# EAGLE design marquee-neopixel (EAGLE 8.6.1)
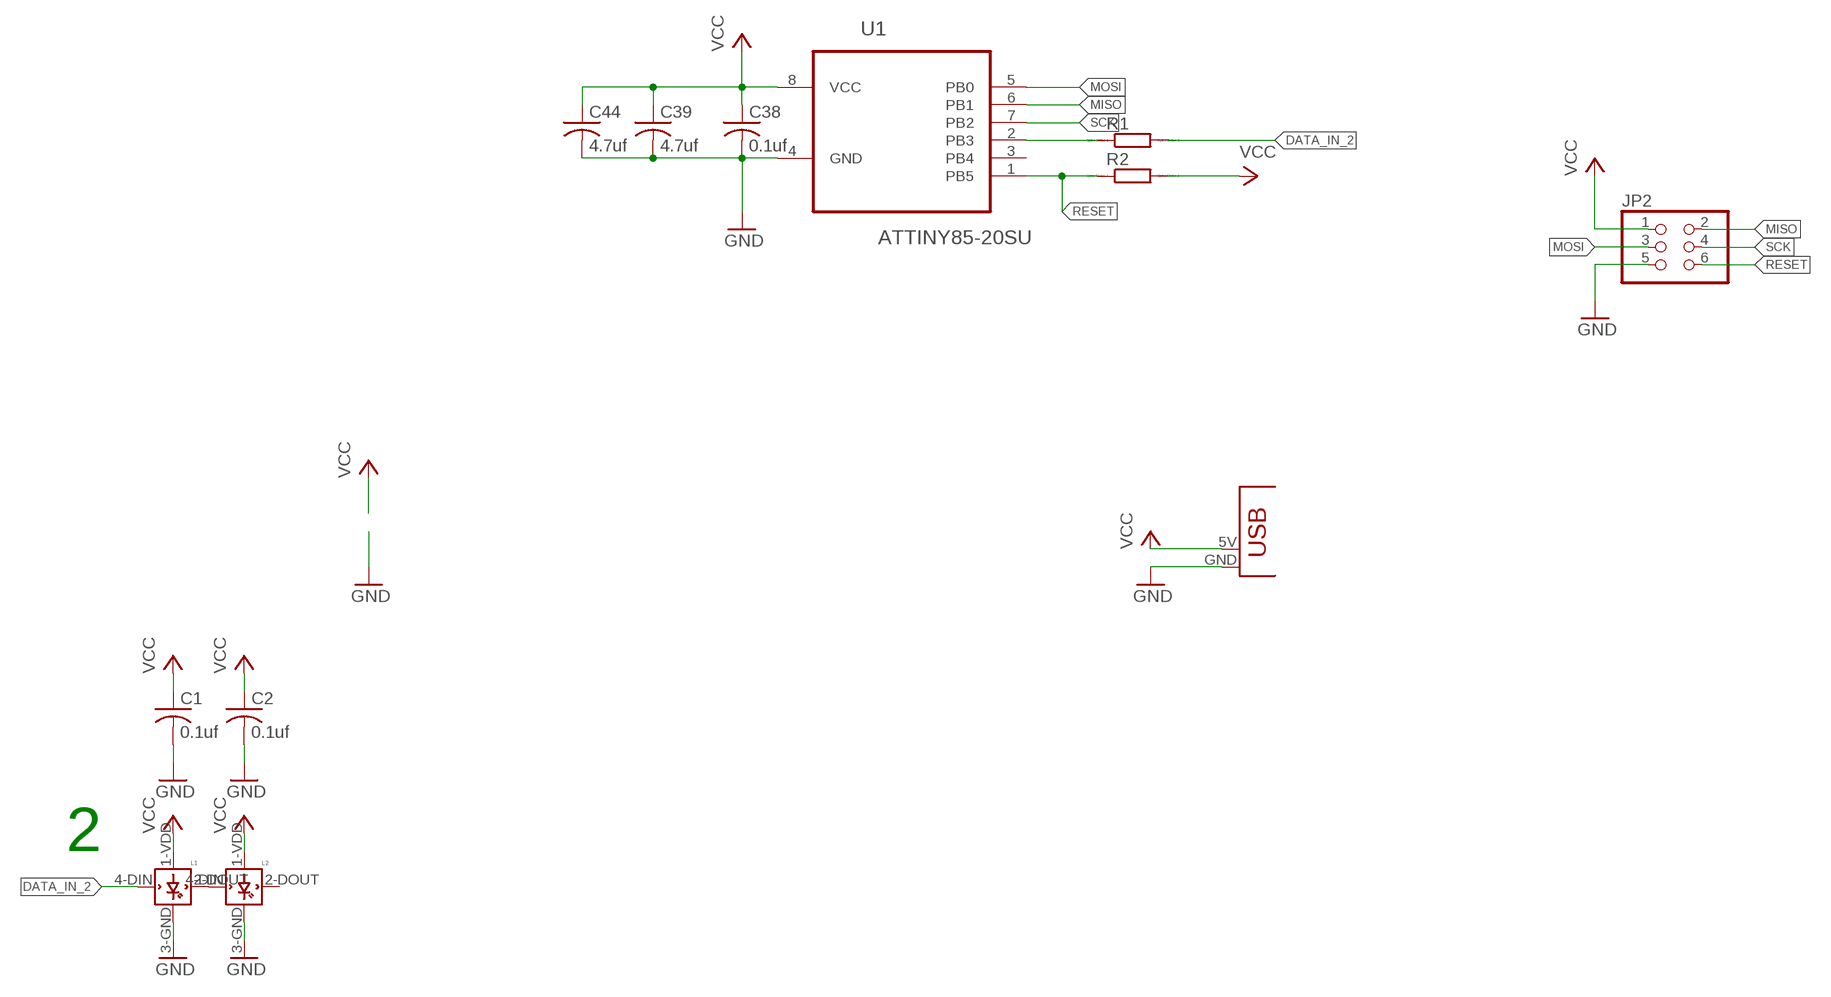
[diagram p0: schematic, sheet 1]

## Parts
C1  0.1uf  C-USC0603  [C0603]
C2  0.1uf  C-USC0603  [C0603]
C38  0.1uf  C-USC0603  [C0603]
C39  4.7uf  C-USC0603  [C0603]
C44  4.7uf  C-USC0603  [C0603]
JP2  PINHD-2X3  [2X03]
L1  WS2812B  [WS2812B]
L2  WS2812B  [WS2812B]
R1  RR0603  [R0603]
R2  RR0603  [R0603]
U1  ATTINY85-20SU  [SOIC127P798X216-8N]
U$1  USB-POWER-ONLY  [USB-A-PCB-POWER-ONLY]

## Nets
DATA_IN_2: L1.4-DIN(DIN) R1.2
GND: C1.2 C2.2 C38.2 C39.2 C44.2 JP2.5 L1.3-GND(GND) L2.3-GND(GND) U1.4(GND) U$1.GND
MISO: JP2.2 U1.6(PB1)
MOSI: JP2.3 U1.5(PB0)
N$1: L1.2-DOUT(DOUT) L2.4-DIN(DIN)
N$25: R1.1 U1.2(PB3)
RESET: JP2.6 R2.1 U1.1(PB5)
SCK: JP2.4 U1.7(PB2)
VCC: C1.1 C2.1 C38.1 C39.1 C44.1 JP2.1 L1.1-VDD(VDD) L2.1-VDD(VDD) R2.2 U1.8(VCC) U$1.5V(VBUS)
Unconnected: L2.2-DOUT(DOUT) U1.3(PB4)

## Notes on the sheet
- 2

## Library data of the parts
C1 C2 C38 C39 C44 = rcl:C-US: CAPACITOR, American symbol; SPICEPREFIX: C
JP2 = pinhead:PINHD-2X3: PIN HEADER
L1 L2 = Duly_Drive-FINAL:WS2812B; SPICEPREFIX: E
R1 R2 = eagle-ltspice:R: RESISTOR, European symbol; SPICEMODEL: NONE; SPICEPREFIX: R
U1 = Atmel_By_element14_Batch_1:ATTINY85-20SU: 8-bit Microcontroller with In-System Programmable Flash; MPN: ATTINY85-20SU; OC_FARNELL: 1455164; OC_NEWARK: 58M3797; PACKAGE: SOIC-8; SUPPLIER: Atmel
U$1 = Andy_Sigler:USB-POWER-ONLY

## Board
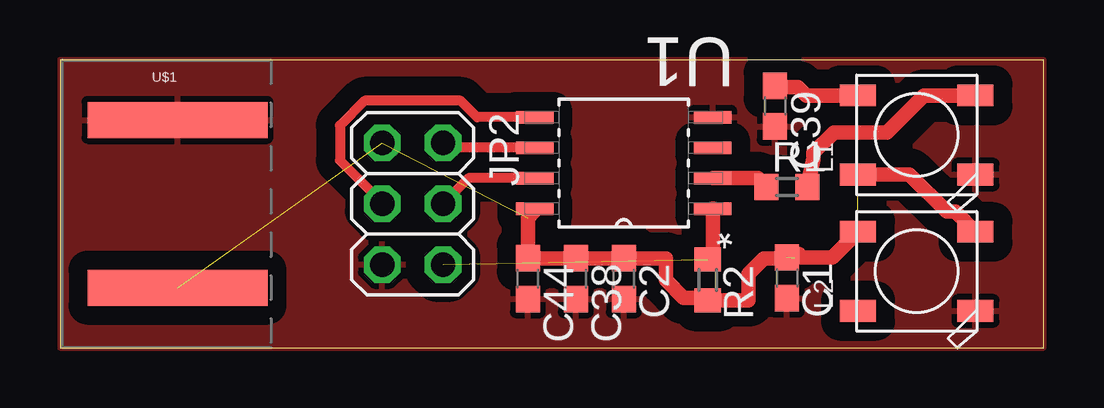
[diagram p1: board, top side]

Size 41 x 12 mm. Coordinates in mm from the lower left corner, seen from the top.
Outline: 0,0 41,0 41,12 0,12 0,0
Copper layers (1*16): Top 0.035mm / dielectric 1.5mm / Bottom 0.035mm
Design rules "OthermillDRC_1_32_v2": minimum track width 8mil, minimum drill 0.8mm, track to track 0.794003125mm, track to pad 0.794003125mm, pad to pad 0.794003125mm, via to via 0.794003125mm, smd to smd 0mil, copper to edge 0mil, drill to drill 1mil, minimum pad ring 10mil, minimum via ring 10mil, stop-mask expansion 1mil, vias tented up to drill 30mil, thermal gap 10mil

### Footprints (pad centres in the part's own frame; a part is rotated, then mirrored left to right if it is on the bottom)
C0603 = smd 1.1 x 1: 1 -0.85,0; 2 0.85,0
2X03 = drill 1.016 octagon: 1 -2.54,-1.27; 2 -2.54,1.27; 3 0,-1.27; 4 0,1.27; 5 2.54,-1.27; 6 2.54,1.27
WS2812B = smd 1.5 x 0.9: 1-VDD 2.45,-1.65; 2-DOUT 2.45,1.65; 3-GND -2.45,1.65; 4-DIN -2.45,-1.65
R0603 = smd 1 x 1.1: 1 -0.85,0; 2 0.85,0
SOIC127P798X216-8N = smd 1.549 x 0.533: 1 -3.708,1.905; 2 -3.708,0.635; 3 -3.708,-0.635; 4 -3.708,-1.905; 5 3.708,-1.905; 6 3.708,-0.635; 7 3.708,0.635; 8 3.708,1.905
USB-A-PCB-POWER-ONLY = smd 7.5 x 1.5: 5V -0.2,-3.5; GND -0.2,3.5

### Placement (x,y rotation side)
C1  30.3,2.91 270 top
C2  23.5,2.88 270 top
C38  21.5,2.88 270 top
C39  29.8,10.07 270 top
C44  19.5,2.88 270 top
JP2  14.7,6 270 top
L1  35.72,8.87 180 top
L2  35.72,3.18 180 top
R1  30.3,6.7 0 top
R2  27,2.83 270 top
U1  23.5,7.7 180 top
U$1  5.1,6 0 top

### Tracks (layer width: path | path; a pad name or v marks a point on that pad's centre or on a via)
DATA_IN_2
  Top 0.61: R1.2 31.42,7.87 31.42,8.12 32.26,8.97 34.47,8.97 36.02,10.52 L1.4-DIN
GND
  pour Top: 0,0 41,0 41,12 0,12
MISO
  Top 0.406: U1.6 16.18,8.34 JP2.2
MOSI
  Top 0.406: U1.5 17.39,9.61 16.7,10.3 12.7,10.3 11.67,9.27 11.67,7.81 13.43,6.05 JP2.3
N$1
  Top 0.61: L2.4-DIN 37.32,5.67 36.96,5.67 35.41,7.22 L1.2-DOUT
N$25
  Top 0.61: U1.2 29.09,7.07 R1.1
RESET  (1 unrouted)
  Top 0.61: U1.1 27.21,3.68 R2.1
SCK
  Top 0.406: U1.7 17.04,7.07 JP2.4
VCC  (4 unrouted)
  Top 0.406: 19.79,5.7 U1.8
  Top 0.61: 19.45,3.67 C44.1 | C44.1 C38.1 C2.1 25.25,3.73 25.25,2.82 26,2.08 26.9,2.08 R2.2 28.7,1.98 28.7,3.06 29.34,3.71 30.61,3.71 30.8,3.9 | C44.1 19.5,5.41 19.79,5.7 | L1.1-VDD 31.11,10.52 30.75,10.87 29.85,10.87 C39.1 | C1.1 32.2,3.76 L2.1-VDD